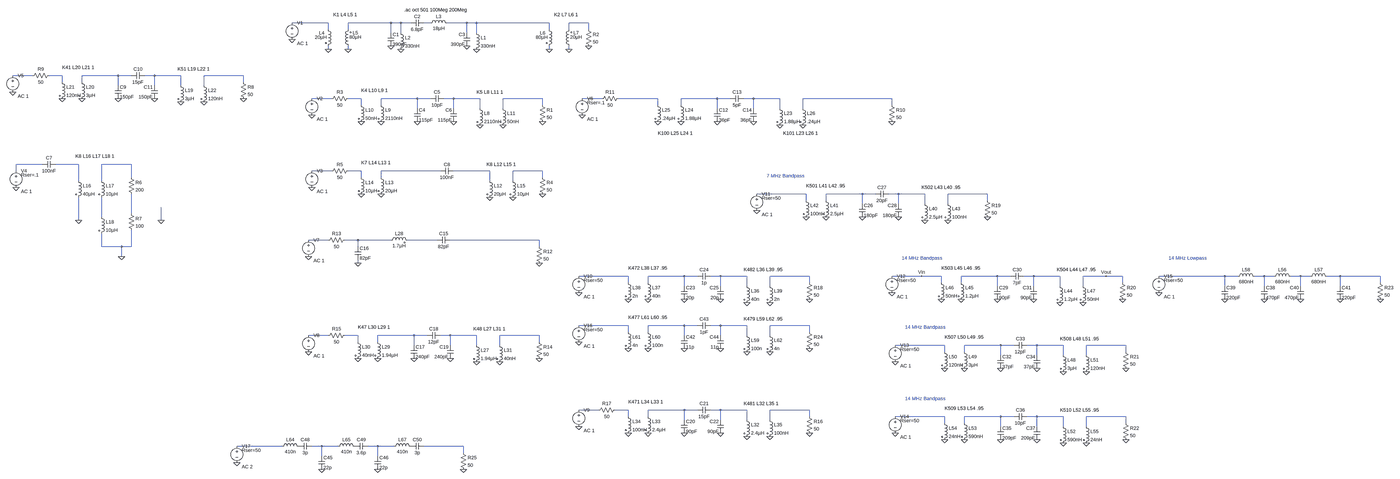
[diagram p0: schematic bandpass.asc, whole sheet]
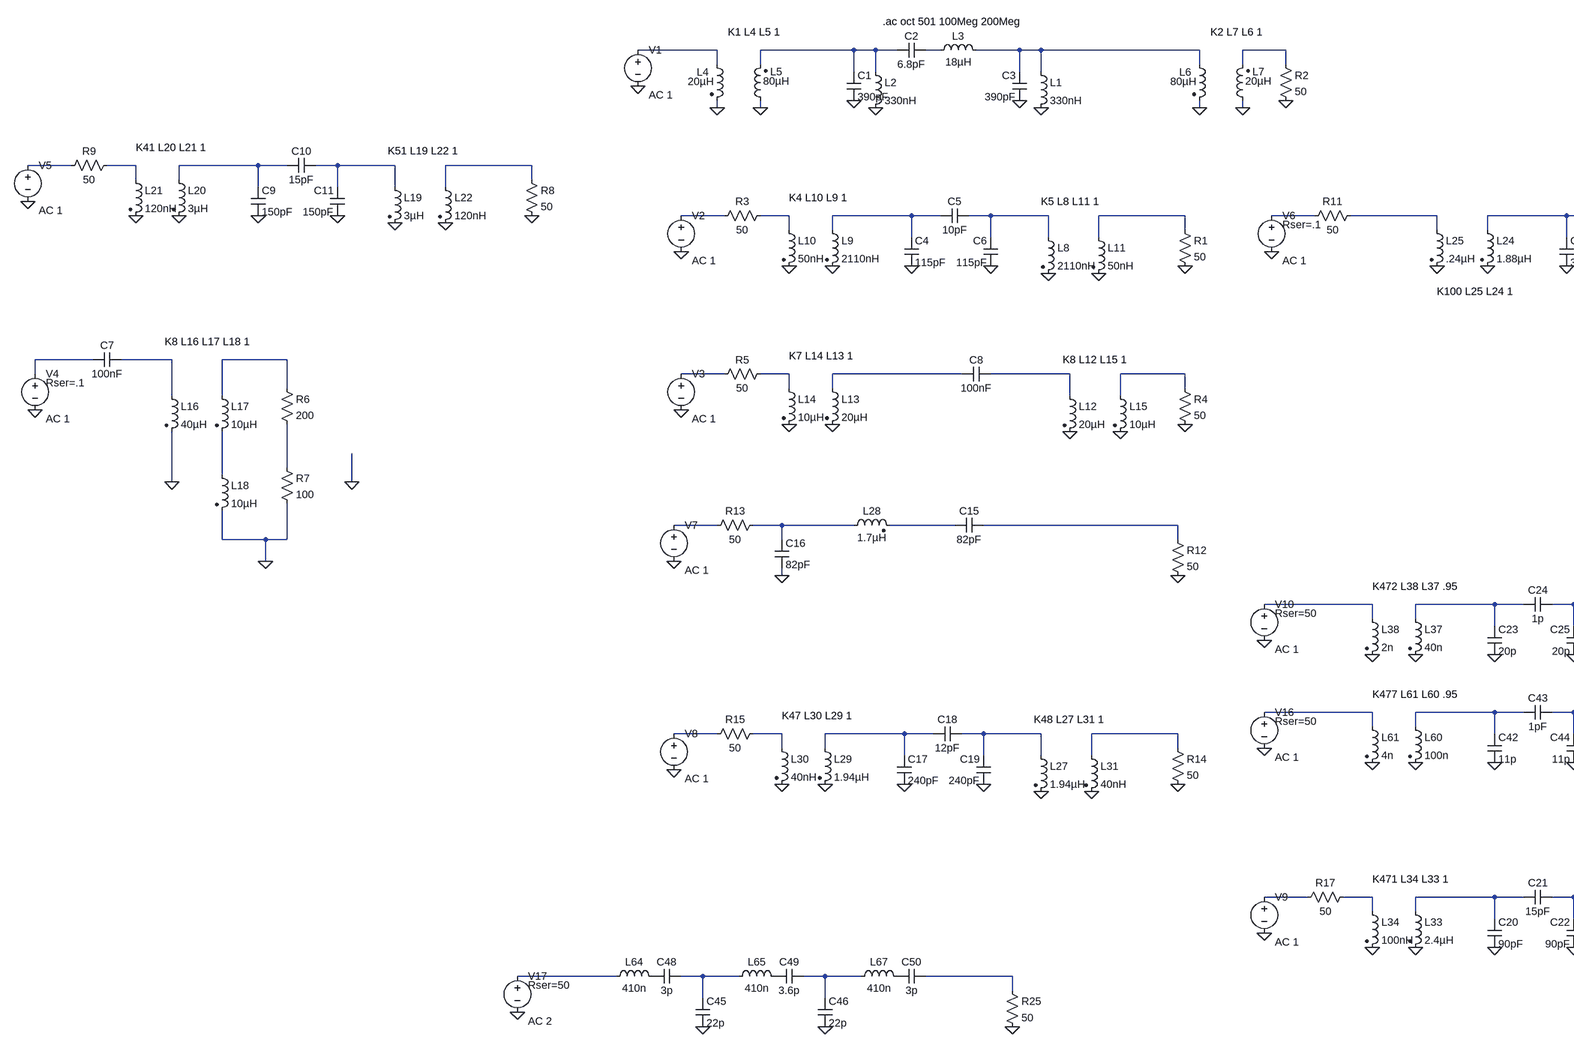
[diagram p1: schematic bandpass.asc, part, row 1 of 1, column 1 of 2]
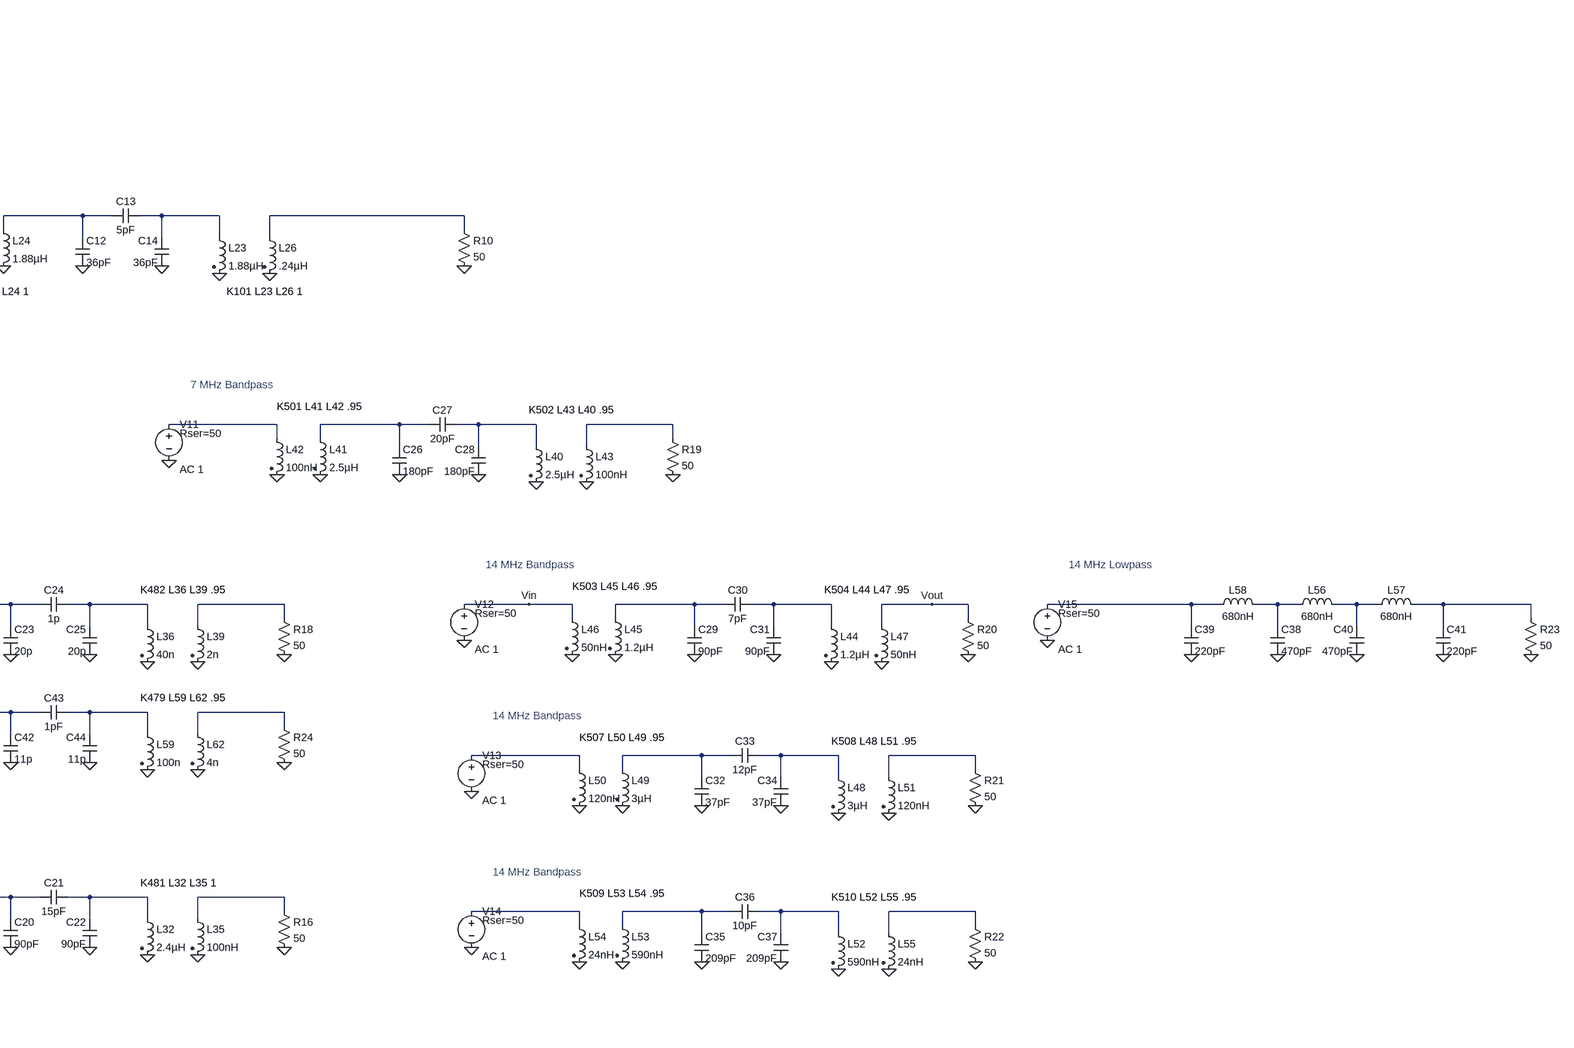
[diagram p2: schematic bandpass.asc, part, row 1 of 1, column 2 of 2]
bandpass.asc, the LTspice schematic file:
Version 4
SHEET 1 4948 2308
WIRE -272 96 -448 96
WIRE 32 96 -176 96
WIRE 80 96 32 96
WIRE 128 96 80 96
WIRE 224 96 192 96
WIRE 400 96 304 96
WIRE 448 96 400 96
WIRE 800 96 448 96
WIRE 992 96 896 96
WIRE -272 128 -272 96
WIRE -176 128 -176 96
WIRE 800 128 800 96
WIRE 896 128 896 96
WIRE 992 128 992 96
WIRE 32 144 32 96
WIRE 80 144 80 96
WIRE 400 144 400 96
WIRE 448 144 448 96
WIRE -272 224 -272 208
WIRE -176 224 -176 208
WIRE 800 224 800 208
WIRE 896 224 896 208
WIRE -1728 352 -1824 352
WIRE -1584 352 -1648 352
WIRE -1312 352 -1488 352
WIRE -1248 352 -1312 352
WIRE -1136 352 -1184 352
WIRE -1008 352 -1136 352
WIRE -704 352 -896 352
WIRE -1584 384 -1584 352
WIRE -1488 384 -1488 352
WIRE -704 384 -704 352
WIRE -1312 400 -1312 352
WIRE -1136 400 -1136 352
WIRE -1008 400 -1008 352
WIRE -896 400 -896 352
WIRE -256 464 -352 464
WIRE -112 464 -176 464
WIRE 160 464 -16 464
WIRE 224 464 160 464
WIRE 336 464 288 464
WIRE 464 464 336 464
WIRE 768 464 576 464
WIRE 1056 464 960 464
WIRE 1328 464 1136 464
WIRE 1616 464 1440 464
WIRE 1680 464 1616 464
WIRE 1792 464 1744 464
WIRE 1920 464 1792 464
WIRE 2464 464 2032 464
WIRE -112 496 -112 464
WIRE -16 496 -16 464
WIRE 768 496 768 464
WIRE 1328 496 1328 464
WIRE 1440 496 1440 464
WIRE 2464 496 2464 464
WIRE 160 512 160 464
WIRE 336 512 336 464
WIRE 464 512 464 464
WIRE 576 512 576 464
WIRE 1616 512 1616 464
WIRE 1792 512 1792 464
WIRE 1920 512 1920 464
WIRE 2032 512 2032 464
WIRE -1680 784 -1808 784
WIRE -1504 784 -1616 784
WIRE -1248 784 -1392 784
WIRE -1808 816 -1808 784
WIRE -256 816 -352 816
WIRE -112 816 -176 816
WIRE 272 816 -16 816
WIRE 512 816 336 816
WIRE 768 816 624 816
WIRE -1248 848 -1248 784
WIRE -112 848 -112 816
WIRE -16 848 -16 816
WIRE 768 848 768 816
WIRE -1504 864 -1504 784
WIRE -1392 864 -1392 784
WIRE 512 864 512 816
WIRE 624 864 624 816
WIRE 2048 928 1808 928
WIRE 2320 928 2144 928
WIRE 2384 928 2320 928
WIRE 2496 928 2448 928
WIRE 2624 928 2496 928
WIRE 2928 928 2736 928
WIRE 2048 960 2048 928
WIRE 2144 960 2144 928
WIRE 2928 960 2928 928
WIRE 2320 976 2320 928
WIRE 2496 976 2496 928
WIRE 2624 976 2624 928
WIRE 2736 976 2736 928
WIRE -1248 1024 -1248 928
WIRE -1392 1040 -1392 944
WIRE -1504 1056 -1504 944
WIRE -1104 1056 -1104 992
WIRE -272 1152 -368 1152
WIRE -128 1152 -192 1152
WIRE 32 1152 -128 1152
WIRE 256 1152 112 1152
WIRE 752 1152 320 1152
WIRE -1392 1184 -1392 1120
WIRE -1296 1184 -1392 1184
WIRE -1248 1184 -1248 1104
WIRE -1248 1184 -1296 1184
WIRE -128 1184 -128 1152
WIRE 752 1184 752 1152
WIRE -1296 1232 -1296 1184
WIRE -128 1264 -128 1248
WIRE 1184 1328 944 1328
WIRE 1456 1328 1280 1328
WIRE 1520 1328 1456 1328
WIRE 1632 1328 1584 1328
WIRE 1760 1328 1632 1328
WIRE 2064 1328 1872 1328
WIRE 2608 1328 2464 1328
WIRE 2704 1328 2608 1328
WIRE 2976 1328 2800 1328
WIRE 3040 1328 2976 1328
WIRE 3152 1328 3104 1328
WIRE 3280 1328 3152 1328
WIRE 3504 1328 3392 1328
WIRE 3584 1328 3504 1328
WIRE 4080 1328 3760 1328
WIRE 4144 1328 4080 1328
WIRE 4272 1328 4224 1328
WIRE 4320 1328 4272 1328
WIRE 4448 1328 4400 1328
WIRE 4496 1328 4448 1328
WIRE 4640 1328 4576 1328
WIRE 4880 1328 4640 1328
WIRE 1184 1360 1184 1328
WIRE 1280 1360 1280 1328
WIRE 2064 1360 2064 1328
WIRE 2704 1360 2704 1328
WIRE 2800 1360 2800 1328
WIRE 3584 1360 3584 1328
WIRE 4880 1360 4880 1328
WIRE 1456 1376 1456 1328
WIRE 1632 1376 1632 1328
WIRE 1760 1376 1760 1328
WIRE 1872 1376 1872 1328
WIRE 2976 1376 2976 1328
WIRE 3152 1376 3152 1328
WIRE 3280 1376 3280 1328
WIRE 3392 1376 3392 1328
WIRE 4080 1376 4080 1328
WIRE 4272 1376 4272 1328
WIRE 4448 1376 4448 1328
WIRE 4640 1376 4640 1328
WIRE 1184 1568 944 1568
WIRE 1456 1568 1280 1568
WIRE 1520 1568 1456 1568
WIRE 1632 1568 1584 1568
WIRE 1760 1568 1632 1568
WIRE 2064 1568 1872 1568
WIRE 1184 1600 1184 1568
WIRE 1280 1600 1280 1568
WIRE 2064 1600 2064 1568
WIRE -272 1616 -368 1616
WIRE -128 1616 -192 1616
WIRE 144 1616 -32 1616
WIRE 208 1616 144 1616
WIRE 320 1616 272 1616
WIRE 448 1616 320 1616
WIRE 752 1616 560 1616
WIRE 1456 1616 1456 1568
WIRE 1632 1616 1632 1568
WIRE 1760 1616 1760 1568
WIRE 1872 1616 1872 1568
WIRE -128 1648 -128 1616
WIRE -32 1648 -32 1616
WIRE 752 1648 752 1616
WIRE 144 1664 144 1616
WIRE 320 1664 320 1616
WIRE 448 1664 448 1616
WIRE 560 1664 560 1616
WIRE 2720 1664 2480 1664
WIRE 2992 1664 2816 1664
WIRE 3056 1664 2992 1664
WIRE 3168 1664 3120 1664
WIRE 3296 1664 3168 1664
WIRE 3600 1664 3408 1664
WIRE 2720 1696 2720 1664
WIRE 2816 1696 2816 1664
WIRE 3600 1696 3600 1664
WIRE 2992 1712 2992 1664
WIRE 3168 1712 3168 1664
WIRE 3296 1712 3296 1664
WIRE 3408 1712 3408 1664
WIRE 1040 1984 944 1984
WIRE 1184 1984 1120 1984
WIRE 1456 1984 1280 1984
WIRE 1520 1984 1456 1984
WIRE 1632 1984 1584 1984
WIRE 1760 1984 1632 1984
WIRE 2064 1984 1872 1984
WIRE 1184 2016 1184 1984
WIRE 1280 2016 1280 1984
WIRE 2064 2016 2064 1984
WIRE 2720 2016 2480 2016
WIRE 2992 2016 2816 2016
WIRE 3056 2016 2992 2016
WIRE 3168 2016 3120 2016
WIRE 3296 2016 3168 2016
WIRE 3600 2016 3408 2016
WIRE 1456 2032 1456 1984
WIRE 1632 2032 1632 1984
WIRE 1760 2032 1760 1984
WIRE 1872 2032 1872 1984
WIRE 2720 2048 2720 2016
WIRE 2816 2048 2816 2016
WIRE 3600 2048 3600 2016
WIRE 2992 2064 2992 2016
WIRE 3168 2064 3168 2016
WIRE 3296 2064 3296 2016
WIRE 3408 2064 3408 2016
WIRE -496 2160 -736 2160
WIRE -304 2160 -352 2160
WIRE -224 2160 -304 2160
WIRE -32 2160 -80 2160
WIRE 48 2160 -32 2160
WIRE 384 2160 192 2160
WIRE 384 2192 384 2160
WIRE -304 2208 -304 2160
WIRE -32 2208 -32 2160
FLAG 32 208 0
FLAG 80 224 0
FLAG 400 208 0
FLAG 448 224 0
FLAG -448 176 0
FLAG -272 224 0
FLAG -176 224 0
FLAG 800 224 0
FLAG 896 224 0
FLAG 992 208 0
FLAG 160 576 0
FLAG -16 576 0
FLAG 336 576 0
FLAG 464 592 0
FLAG -352 544 0
FLAG -112 576 0
FLAG 576 592 0
FLAG 768 576 0
FLAG -16 928 0
FLAG 512 944 0
FLAG -352 896 0
FLAG -112 928 0
FLAG 624 944 0
FLAG 768 928 0
FLAG -1808 896 0
FLAG -1504 1056 0
FLAG -1104 1056 0
FLAG -1296 1232 0
FLAG -1312 464 0
FLAG -1488 464 0
FLAG -1136 464 0
FLAG -1008 480 0
FLAG -1824 432 0
FLAG -1584 464 0
FLAG -896 480 0
FLAG -704 464 0
FLAG 1616 576 0
FLAG 1440 576 0
FLAG 1792 576 0
FLAG 1920 592 0
FLAG 960 544 0
FLAG 2464 576 0
FLAG 1328 576 0
FLAG 2032 592 0
FLAG -368 1232 0
FLAG -128 1264 0
FLAG 752 1264 0
FLAG 144 1728 0
FLAG -32 1728 0
FLAG 320 1728 0
FLAG 448 1744 0
FLAG -368 1696 0
FLAG -128 1728 0
FLAG 560 1744 0
FLAG 752 1728 0
FLAG 1456 2096 0
FLAG 1280 2096 0
FLAG 1632 2096 0
FLAG 1760 2112 0
FLAG 944 2064 0
FLAG 1184 2096 0
FLAG 1872 2112 0
FLAG 2064 2096 0
FLAG 1456 1440 0
FLAG 1280 1440 0
FLAG 1632 1440 0
FLAG 1760 1456 0
FLAG 944 1408 0
FLAG 1184 1440 0
FLAG 1872 1456 0
FLAG 2064 1440 0
FLAG 2320 1040 0
FLAG 2144 1040 0
FLAG 2496 1040 0
FLAG 2624 1056 0
FLAG 1808 1008 0
FLAG 2048 1040 0
FLAG 2736 1056 0
FLAG 2928 1040 0
FLAG 2976 1440 0
FLAG 2800 1440 0
FLAG 3152 1440 0
FLAG 3280 1456 0
FLAG 2464 1408 0
FLAG 2704 1440 0
FLAG 3392 1456 0
FLAG 3584 1440 0
FLAG 2608 1328 Vin
FLAG 3504 1328 Vout
FLAG 2992 1776 0
FLAG 2816 1776 0
FLAG 3168 1776 0
FLAG 3296 1792 0
FLAG 2480 1744 0
FLAG 2720 1776 0
FLAG 3408 1792 0
FLAG 3600 1776 0
FLAG 2992 2128 0
FLAG 2816 2128 0
FLAG 3168 2128 0
FLAG 3296 2144 0
FLAG 2480 2096 0
FLAG 2720 2128 0
FLAG 3408 2144 0
FLAG 3600 2128 0
FLAG 4272 1440 0
FLAG 4448 1440 0
FLAG 3760 1408 0
FLAG 4880 1440 0
FLAG 4080 1440 0
FLAG 4640 1440 0
FLAG 1456 1680 0
FLAG 1280 1680 0
FLAG 1632 1680 0
FLAG 1760 1696 0
FLAG 944 1648 0
FLAG 1184 1680 0
FLAG 1872 1696 0
FLAG 2064 1680 0
FLAG -736 2240 0
FLAG 384 2272 0
FLAG -304 2272 0
FLAG -32 2272 0
SYMBOL cap 16 144 R0
SYMATTR InstName C1
SYMATTR Value 390pF
SYMBOL cap 192 80 R90
WINDOW 0 0 32 VBottom 2
WINDOW 3 32 32 VTop 2
SYMATTR InstName C2
SYMATTR Value 6.8pF
SYMBOL cap 416 208 R180
WINDOW 0 24 56 Left 2
WINDOW 3 24 8 Left 2
SYMATTR InstName C3
SYMATTR Value 390pF
SYMBOL ind 432 128 R0
SYMATTR InstName L1
SYMATTR Value 330nH
SYMBOL ind 64 128 R0
SYMATTR InstName L2
SYMATTR Value 330nH
SYMBOL ind 208 112 R270
WINDOW 0 32 56 VTop 2
WINDOW 3 5 56 VBottom 2
SYMATTR InstName L3
SYMATTR Value 18µH
SYMBOL voltage -448 80 R0
WINDOW 123 24 116 Left 2
WINDOW 39 0 0 Left 0
SYMATTR Value2 AC 1
SYMATTR InstName V1
SYMATTR Value ""
SYMBOL ind2 -288 112 R0
WINDOW 0 -29 33 Left 2
WINDOW 3 -49 54 Left 2
SYMATTR InstName L4
SYMATTR Value 20µH
SYMATTR Type ind
SYMBOL ind2 -160 224 R180
WINDOW 0 -33 80 Left 2
WINDOW 3 -48 59 Left 2
SYMATTR InstName L5
SYMATTR Value 80µH
SYMATTR Type ind
SYMBOL ind2 784 112 R0
WINDOW 0 -29 33 Left 2
WINDOW 3 -49 54 Left 2
SYMATTR InstName L6
SYMATTR Value 80µH
SYMATTR Type ind
SYMBOL ind2 912 224 R180
WINDOW 0 -33 80 Left 2
WINDOW 3 -48 59 Left 2
SYMATTR InstName L7
SYMATTR Value 20µH
SYMATTR Type ind
SYMBOL res 976 112 R0
SYMATTR InstName R2
SYMATTR Value 50
SYMBOL cap 144 512 R0
SYMATTR InstName C4
SYMATTR Value 115pF
SYMBOL cap 288 448 R90
WINDOW 0 0 32 VBottom 2
WINDOW 3 32 32 VTop 2
SYMATTR InstName C5
SYMATTR Value 10pF
SYMBOL cap 352 576 R180
WINDOW 0 24 56 Left 2
WINDOW 3 24 8 Left 2
SYMATTR InstName C6
SYMATTR Value 115pF
SYMBOL ind2 448 496 R0
SYMATTR InstName L8
SYMATTR Value 2110nH
SYMATTR Type ind
SYMBOL ind2 -32 480 R0
SYMATTR InstName L9
SYMATTR Value 2110nH
SYMATTR Type ind
SYMBOL voltage -352 448 R0
WINDOW 123 24 116 Left 2
WINDOW 39 0 0 Left 0
SYMATTR Value2 AC 1
SYMATTR InstName V2
SYMATTR Value ""
SYMBOL ind2 -128 480 R0
SYMATTR InstName L10
SYMATTR Value 50nH
SYMATTR Type ind
SYMBOL ind2 560 496 R0
SYMATTR InstName L11
SYMATTR Value 50nH
SYMATTR Type ind
SYMBOL res 752 480 R0
SYMATTR InstName R1
SYMATTR Value 50
SYMBOL res -160 448 R90
WINDOW 0 0 56 VBottom 2
WINDOW 3 32 56 VTop 2
SYMATTR InstName R3
SYMATTR Value 50
SYMBOL cap 336 800 R90
WINDOW 0 0 32 VBottom 2
WINDOW 3 32 32 VTop 2
SYMATTR InstName C8
SYMATTR Value 100nF
SYMBOL ind2 496 848 R0
SYMATTR InstName L12
SYMATTR Value 20µH
SYMATTR Type ind
SYMBOL ind2 -32 832 R0
SYMATTR InstName L13
SYMATTR Value 20µH
SYMATTR Type ind
SYMBOL voltage -352 800 R0
WINDOW 123 24 116 Left 2
WINDOW 39 0 0 Left 0
SYMATTR Value2 AC 1
SYMATTR InstName V3
SYMATTR Value ""
SYMBOL ind2 -128 832 R0
SYMATTR InstName L14
SYMATTR Value 10µH
SYMATTR Type ind
SYMBOL ind2 608 848 R0
SYMATTR InstName L15
SYMATTR Value 10µH
SYMATTR Type ind
SYMBOL res 752 832 R0
SYMATTR InstName R4
SYMATTR Value 50
SYMBOL res -160 800 R90
WINDOW 0 0 56 VBottom 2
WINDOW 3 32 56 VTop 2
SYMATTR InstName R5
SYMATTR Value 50
SYMBOL ind2 -1520 848 R0
SYMATTR InstName L16
SYMATTR Value 40µH
SYMATTR Type ind
SYMBOL ind2 -1408 848 R0
SYMATTR InstName L17
SYMATTR Value 10µH
SYMATTR Type ind
SYMBOL voltage -1808 800 R0
WINDOW 123 24 116 Left 2
WINDOW 39 24 36 Left 2
SYMATTR Value2 AC 1
SYMATTR SpiceLine Rser=.1
SYMATTR InstName V4
SYMATTR Value ""
SYMBOL ind2 -1408 1024 R0
SYMATTR InstName L18
SYMATTR Value 10µH
SYMATTR Type ind
SYMBOL res -1264 832 R0
SYMATTR InstName R6
SYMATTR Value 200
SYMBOL res -1264 1008 R0
SYMATTR InstName R7
SYMATTR Value 100
SYMBOL cap -1616 768 R90
WINDOW 0 0 32 VBottom 2
WINDOW 3 32 32 VTop 2
SYMATTR InstName C7
SYMATTR Value 100nF
SYMBOL cap -1328 400 R0
SYMATTR InstName C9
SYMATTR Value 150pF
SYMBOL cap -1184 336 R90
WINDOW 0 0 32 VBottom 2
WINDOW 3 32 32 VTop 2
SYMATTR InstName C10
SYMATTR Value 15pF
SYMBOL cap -1120 464 R180
WINDOW 0 24 56 Left 2
WINDOW 3 24 8 Left 2
SYMATTR InstName C11
SYMATTR Value 150pF
SYMBOL ind2 -1024 384 R0
SYMATTR InstName L19
SYMATTR Value 3µH
SYMATTR Type ind
SYMBOL ind2 -1504 368 R0
SYMATTR InstName L20
SYMATTR Value 3µH
SYMATTR Type ind
SYMBOL voltage -1824 336 R0
WINDOW 123 24 116 Left 2
WINDOW 39 24 36 Left 2
SYMATTR Value2 AC 1
SYMATTR InstName V5
SYMATTR Value ""
SYMBOL ind2 -1600 368 R0
SYMATTR InstName L21
SYMATTR Value 120nH
SYMATTR Type ind
SYMBOL ind2 -912 384 R0
SYMATTR InstName L22
SYMATTR Value 120nH
SYMATTR Type ind
SYMBOL res -720 368 R0
SYMATTR InstName R8
SYMATTR Value 50
SYMBOL res -1632 336 R90
WINDOW 0 0 56 VBottom 2
WINDOW 3 32 56 VTop 2
SYMATTR InstName R9
SYMATTR Value 50
SYMBOL cap 1600 512 R0
SYMATTR InstName C12
SYMATTR Value 36pF
SYMBOL cap 1744 448 R90
WINDOW 0 0 32 VBottom 2
WINDOW 3 32 32 VTop 2
SYMATTR InstName C13
SYMATTR Value 5pF
SYMBOL cap 1808 576 R180
WINDOW 0 24 56 Left 2
WINDOW 3 24 8 Left 2
SYMATTR InstName C14
SYMATTR Value 36pF
SYMBOL ind2 1904 496 R0
SYMATTR InstName L23
SYMATTR Value 1.88µH
SYMATTR Type ind
SYMBOL ind2 1424 480 R0
SYMATTR InstName L24
SYMATTR Value 1.88µH
SYMATTR Type ind
SYMBOL voltage 960 448 R0
WINDOW 123 24 116 Left 2
WINDOW 39 24 36 Left 2
SYMATTR Value2 AC 1
SYMATTR SpiceLine Rser=.1
SYMATTR InstName V6
SYMATTR Value ""
SYMBOL res 2448 480 R0
SYMATTR InstName R10
SYMATTR Value 50
SYMBOL res 1152 448 R90
WINDOW 0 0 56 VBottom 2
WINDOW 3 32 56 VTop 2
SYMATTR InstName R11
SYMATTR Value 50
SYMBOL ind2 1312 480 R0
SYMATTR InstName L25
SYMATTR Value .24µH
SYMATTR Type ind
SYMBOL ind2 2016 496 R0
SYMATTR InstName L26
SYMATTR Value .24µH
SYMATTR Type ind
SYMBOL cap 320 1136 R90
WINDOW 0 0 32 VBottom 2
WINDOW 3 32 32 VTop 2
SYMATTR InstName C15
SYMATTR Value 82pF
SYMBOL ind2 16 1168 R270
WINDOW 0 32 56 VTop 2
WINDOW 3 4 56 VBottom 2
SYMATTR InstName L28
SYMATTR Value 1.7µH
SYMATTR Type ind
SYMBOL voltage -368 1136 R0
WINDOW 123 24 116 Left 2
WINDOW 39 0 0 Left 0
SYMATTR Value2 AC 1
SYMATTR InstName V7
SYMATTR Value ""
SYMBOL res 736 1168 R0
SYMATTR InstName R12
SYMATTR Value 50
SYMBOL res -176 1136 R90
WINDOW 0 0 56 VBottom 2
WINDOW 3 32 56 VTop 2
SYMATTR InstName R13
SYMATTR Value 50
SYMBOL cap -144 1184 R0
SYMATTR InstName C16
SYMATTR Value 82pF
SYMBOL cap 128 1664 R0
SYMATTR InstName C17
SYMATTR Value 240pF
SYMBOL cap 272 1600 R90
WINDOW 0 0 32 VBottom 2
WINDOW 3 32 32 VTop 2
SYMATTR InstName C18
SYMATTR Value 12pF
SYMBOL cap 336 1728 R180
WINDOW 0 24 56 Left 2
WINDOW 3 24 8 Left 2
SYMATTR InstName C19
SYMATTR Value 240pF
SYMBOL ind2 432 1648 R0
SYMATTR InstName L27
SYMATTR Value 1.94µH
SYMATTR Type ind
SYMBOL ind2 -48 1632 R0
SYMATTR InstName L29
SYMATTR Value 1.94µH
SYMATTR Type ind
SYMBOL voltage -368 1600 R0
WINDOW 123 24 116 Left 2
WINDOW 39 0 0 Left 0
SYMATTR Value2 AC 1
SYMATTR InstName V8
SYMATTR Value ""
SYMBOL ind2 -144 1632 R0
SYMATTR InstName L30
SYMATTR Value 40nH
SYMATTR Type ind
SYMBOL ind2 544 1648 R0
SYMATTR InstName L31
SYMATTR Value 40nH
SYMATTR Type ind
SYMBOL res 736 1632 R0
SYMATTR InstName R14
SYMATTR Value 50
SYMBOL res -176 1600 R90
WINDOW 0 0 56 VBottom 2
WINDOW 3 32 56 VTop 2
SYMATTR InstName R15
SYMATTR Value 50
SYMBOL cap 1440 2032 R0
SYMATTR InstName C20
SYMATTR Value 90pF
SYMBOL cap 1584 1968 R90
WINDOW 0 0 32 VBottom 2
WINDOW 3 32 32 VTop 2
SYMATTR InstName C21
SYMATTR Value 15pF
SYMBOL cap 1648 2096 R180
WINDOW 0 24 56 Left 2
WINDOW 3 24 8 Left 2
SYMATTR InstName C22
SYMATTR Value 90pF
SYMBOL ind2 1744 2016 R0
SYMATTR InstName L32
SYMATTR Value 2.4µH
SYMATTR Type ind
SYMBOL ind2 1264 2000 R0
SYMATTR InstName L33
SYMATTR Value 2.4µH
SYMATTR Type ind
SYMBOL voltage 944 1968 R0
WINDOW 123 24 116 Left 2
WINDOW 39 0 0 Left 0
SYMATTR Value2 AC 1
SYMATTR InstName V9
SYMATTR Value ""
SYMBOL ind2 1168 2000 R0
SYMATTR InstName L34
SYMATTR Value 100nH
SYMATTR Type ind
SYMBOL ind2 1856 2016 R0
SYMATTR InstName L35
SYMATTR Value 100nH
SYMATTR Type ind
SYMBOL res 2048 2000 R0
SYMATTR InstName R16
SYMATTR Value 50
SYMBOL res 1136 1968 R90
WINDOW 0 0 56 VBottom 2
WINDOW 3 32 56 VTop 2
SYMATTR InstName R17
SYMATTR Value 50
SYMBOL cap 1440 1376 R0
SYMATTR InstName C23
SYMATTR Value 20p
SYMBOL cap 1584 1312 R90
WINDOW 0 0 32 VBottom 2
WINDOW 3 32 32 VTop 2
SYMATTR InstName C24
SYMATTR Value 1p
SYMBOL cap 1648 1440 R180
WINDOW 0 24 56 Left 2
WINDOW 3 24 8 Left 2
SYMATTR InstName C25
SYMATTR Value 20p
SYMBOL ind2 1744 1360 R0
SYMATTR InstName L36
SYMATTR Value 40n
SYMATTR Type ind
SYMBOL ind2 1264 1344 R0
SYMATTR InstName L37
SYMATTR Value 40n
SYMATTR Type ind
SYMBOL voltage 944 1312 R0
WINDOW 123 24 116 Left 2
WINDOW 39 24 36 Left 2
SYMATTR Value2 AC 1
SYMATTR SpiceLine Rser=50
SYMATTR InstName V10
SYMATTR Value ""
SYMBOL ind2 1168 1344 R0
SYMATTR InstName L38
SYMATTR Value 2n
SYMATTR Type ind
SYMBOL ind2 1856 1360 R0
SYMATTR InstName L39
SYMATTR Value 2n
SYMATTR Type ind
SYMBOL res 2048 1344 R0
SYMATTR InstName R18
SYMATTR Value 50
SYMBOL cap 2304 976 R0
SYMATTR InstName C26
SYMATTR Value 180pF
SYMBOL cap 2448 912 R90
WINDOW 0 0 32 VBottom 2
WINDOW 3 32 32 VTop 2
SYMATTR InstName C27
SYMATTR Value 20pF
SYMBOL cap 2512 1040 R180
WINDOW 0 24 56 Left 2
WINDOW 3 24 8 Left 2
SYMATTR InstName C28
SYMATTR Value 180pF
SYMBOL ind2 2608 960 R0
SYMATTR InstName L40
SYMATTR Value 2.5µH
SYMATTR Type ind
SYMBOL ind2 2128 944 R0
SYMATTR InstName L41
SYMATTR Value 2.5µH
SYMATTR Type ind
SYMBOL voltage 1808 912 R0
WINDOW 123 24 116 Left 2
WINDOW 39 24 36 Left 2
SYMATTR Value2 AC 1
SYMATTR SpiceLine Rser=50
SYMATTR InstName V11
SYMATTR Value ""
SYMBOL ind2 2032 944 R0
SYMATTR InstName L42
SYMATTR Value 100nH
SYMATTR Type ind
SYMBOL ind2 2720 960 R0
SYMATTR InstName L43
SYMATTR Value 100nH
SYMATTR Type ind
SYMBOL res 2912 944 R0
SYMATTR InstName R19
SYMATTR Value 50
SYMBOL cap 2960 1376 R0
SYMATTR InstName C29
SYMATTR Value 90pF
SYMBOL cap 3104 1312 R90
WINDOW 0 0 32 VBottom 2
WINDOW 3 32 32 VTop 2
SYMATTR InstName C30
SYMATTR Value 7pF
SYMBOL cap 3168 1440 R180
WINDOW 0 24 56 Left 2
WINDOW 3 24 8 Left 2
SYMATTR InstName C31
SYMATTR Value 90pF
SYMBOL ind2 3264 1360 R0
SYMATTR InstName L44
SYMATTR Value 1.2µH
SYMATTR Type ind
SYMBOL ind2 2784 1344 R0
SYMATTR InstName L45
SYMATTR Value 1.2µH
SYMATTR Type ind
SYMBOL voltage 2464 1312 R0
WINDOW 123 24 116 Left 2
WINDOW 39 24 36 Left 2
SYMATTR Value2 AC 1
SYMATTR SpiceLine Rser=50
SYMATTR InstName V12
SYMATTR Value ""
SYMBOL ind2 2688 1344 R0
SYMATTR InstName L46
SYMATTR Value 50nH
SYMATTR Type ind
SYMBOL ind2 3376 1360 R0
SYMATTR InstName L47
SYMATTR Value 50nH
SYMATTR Type ind
SYMBOL res 3568 1344 R0
SYMATTR InstName R20
SYMATTR Value 50
SYMBOL cap 2976 1712 R0
SYMATTR InstName C32
SYMATTR Value 37pF
SYMBOL cap 3120 1648 R90
WINDOW 0 0 32 VBottom 2
WINDOW 3 32 32 VTop 2
SYMATTR InstName C33
SYMATTR Value 12pF
SYMBOL cap 3184 1776 R180
WINDOW 0 24 56 Left 2
WINDOW 3 24 8 Left 2
SYMATTR InstName C34
SYMATTR Value 37pF
SYMBOL ind2 3280 1696 R0
SYMATTR InstName L48
SYMATTR Value 3µH
SYMATTR Type ind
SYMBOL ind2 2800 1680 R0
SYMATTR InstName L49
SYMATTR Value 3µH
SYMATTR Type ind
SYMBOL voltage 2480 1648 R0
WINDOW 123 24 116 Left 2
WINDOW 39 24 36 Left 2
SYMATTR Value2 AC 1
SYMATTR SpiceLine Rser=50
SYMATTR InstName V13
SYMATTR Value ""
SYMBOL ind2 2704 1680 R0
SYMATTR InstName L50
SYMATTR Value 120nH
SYMATTR Type ind
SYMBOL ind2 3392 1696 R0
SYMATTR InstName L51
SYMATTR Value 120nH
SYMATTR Type ind
SYMBOL res 3584 1680 R0
SYMATTR InstName R21
SYMATTR Value 50
SYMBOL cap 2976 2064 R0
SYMATTR InstName C35
SYMATTR Value 209pF
SYMBOL cap 3120 2000 R90
WINDOW 0 0 32 VBottom 2
WINDOW 3 32 32 VTop 2
SYMATTR InstName C36
SYMATTR Value 10pF
SYMBOL cap 3184 2128 R180
WINDOW 0 24 56 Left 2
WINDOW 3 24 8 Left 2
SYMATTR InstName C37
SYMATTR Value 209pF
SYMBOL ind2 3280 2048 R0
SYMATTR InstName L52
SYMATTR Value 590nH
SYMATTR Type ind
SYMBOL ind2 2800 2032 R0
SYMATTR InstName L53
SYMATTR Value 590nH
SYMATTR Type ind
SYMBOL voltage 2480 2000 R0
WINDOW 123 24 116 Left 2
WINDOW 39 24 36 Left 2
SYMATTR Value2 AC 1
SYMATTR SpiceLine Rser=50
SYMATTR InstName V14
SYMATTR Value ""
SYMBOL ind2 2704 2032 R0
SYMATTR InstName L54
SYMATTR Value 24nH
SYMATTR Type ind
SYMBOL ind2 3392 2048 R0
SYMATTR InstName L55
SYMATTR Value 24nH
SYMATTR Type ind
SYMBOL res 3584 2032 R0
SYMATTR InstName R22
SYMATTR Value 50
SYMBOL cap 4256 1376 R0
SYMATTR InstName C38
SYMATTR Value 470pF
SYMBOL cap 4464 1440 R180
WINDOW 0 24 56 Left 2
WINDOW 3 24 8 Left 2
SYMATTR InstName C40
SYMATTR Value 470pF
SYMBOL voltage 3760 1312 R0
WINDOW 123 24 116 Left 2
WINDOW 39 24 36 Left 2
SYMATTR Value2 AC 1
SYMATTR SpiceLine Rser=50
SYMATTR InstName V15
SYMATTR Value ""
SYMBOL res 4864 1344 R0
SYMATTR InstName R23
SYMATTR Value 50
SYMBOL ind 4304 1344 R270
WINDOW 0 32 56 VTop 2
WINDOW 3 5 56 VBottom 2
SYMATTR InstName L56
SYMATTR Value 680nH
SYMBOL ind 4480 1344 R270
WINDOW 0 32 56 VTop 2
WINDOW 3 5 56 VBottom 2
SYMATTR InstName L57
SYMATTR Value 680nH
SYMBOL ind 4128 1344 R270
WINDOW 0 32 56 VTop 2
WINDOW 3 5 56 VBottom 2
SYMATTR InstName L58
SYMATTR Value 680nH
SYMBOL cap 4064 1376 R0
SYMATTR InstName C39
SYMATTR Value 220pF
SYMBOL cap 4624 1376 R0
SYMATTR InstName C41
SYMATTR Value 220pF
SYMBOL cap 1440 1616 R0
SYMATTR InstName C42
SYMATTR Value 11p
SYMBOL cap 1584 1552 R90
WINDOW 0 0 32 VBottom 2
WINDOW 3 32 32 VTop 2
SYMATTR InstName C43
SYMATTR Value 1pF
SYMBOL cap 1648 1680 R180
WINDOW 0 24 56 Left 2
WINDOW 3 24 8 Left 2
SYMATTR InstName C44
SYMATTR Value 11p
SYMBOL ind2 1744 1600 R0
SYMATTR InstName L59
SYMATTR Value 100n
SYMATTR Type ind
SYMBOL ind2 1264 1584 R0
SYMATTR InstName L60
SYMATTR Value 100n
SYMATTR Type ind
SYMBOL voltage 944 1552 R0
WINDOW 123 24 116 Left 2
WINDOW 39 24 36 Left 2
SYMATTR Value2 AC 1
SYMATTR SpiceLine Rser=50
SYMATTR InstName V16
SYMATTR Value ""
SYMBOL ind2 1168 1584 R0
SYMATTR InstName L61
SYMATTR Value 4n
SYMATTR Type ind
SYMBOL ind2 1856 1600 R0
SYMATTR InstName L62
SYMATTR Value 4n
SYMATTR Type ind
SYMBOL res 2048 1584 R0
SYMATTR InstName R24
SYMATTR Value 50
SYMBOL voltage -736 2144 R0
WINDOW 123 24 116 Left 2
WINDOW 39 24 36 Left 2
SYMATTR Value2 AC 2
SYMATTR SpiceLine Rser=50
SYMATTR InstName V17
SYMATTR Value ""
SYMBOL res 368 2176 R0
SYMATTR InstName R25
SYMATTR Value 50
SYMBOL ind -512 2176 R270
WINDOW 0 32 56 VTop 2
WINDOW 3 5 56 VBottom 2
SYMATTR InstName L64
SYMATTR Value 410n
SYMBOL cap -352 2144 R90
WINDOW 0 0 32 VBottom 2
WINDOW 3 32 32 VTop 2
SYMATTR InstName C48
SYMATTR Value 3p
SYMBOL ind -240 2176 R270
WINDOW 0 32 56 VTop 2
WINDOW 3 5 56 VBottom 2
SYMATTR InstName L65
SYMATTR Value 410n
SYMBOL cap -80 2144 R90
WINDOW 0 0 32 VBottom 2
WINDOW 3 32 32 VTop 2
SYMATTR InstName C49
SYMATTR Value 3.6p
SYMBOL ind 32 2176 R270
WINDOW 0 32 56 VTop 2
WINDOW 3 5 56 VBottom 2
SYMATTR InstName L67
SYMATTR Value 410n
SYMBOL cap 192 2144 R90
WINDOW 0 0 32 VBottom 2
WINDOW 3 32 32 VTop 2
SYMATTR InstName C50
SYMATTR Value 3p
SYMBOL cap -320 2208 R0
SYMATTR InstName C45
SYMATTR Value 22p
SYMBOL cap -48 2208 R0
SYMATTR InstName C46
SYMATTR Value 22p
TEXT 96 32 Left 2 !.ac oct 501 100Meg 200Meg
TEXT -248 56 Left 2 !K1 L4 L5 1
TEXT 824 56 Left 2 !K2 L7 L6 1
TEXT -112 424 Left 2 !K4 L10 L9 1
TEXT 448 432 Left 2 !K5 L8 L11 1
TEXT -112 776 Left 2 !K7 L14 L13 1
TEXT 496 784 Left 2 !K8 L12 L15 1
TEXT -1520 744 Left 2 !K8 L16 L17 L18 1
TEXT -1584 312 Left 2 !K41 L20 L21 1
TEXT -1024 320 Left 2 !K51 L19 L22 1
TEXT 1328 632 Left 2 !K100 L25 L24 1
TEXT 1936 632 Left 2 !K101 L23 L26 1
TEXT -128 1576 Left 2 !K47 L30 L29 1
TEXT 432 1584 Left 2 !K48 L27 L31 1
TEXT 1184 1944 Left 2 !K471 L34 L33 1
TEXT 1744 1952 Left 2 !K481 L32 L35 1
TEXT 1184 1288 Left 2 !K472 L38 L37 .95
TEXT 1744 1296 Left 2 !K482 L36 L39 .95
TEXT 2048 888 Left 2 !K501 L41 L42 .95
TEXT 2608 896 Left 2 !K502 L43 L40 .95
TEXT 1856 840 Left 2 ;7 MHz Bandpass
TEXT 2704 1288 Left 2 !K503 L45 L46 .95
TEXT 3264 1296 Left 2 !K504 L44 L47 .95
TEXT 2512 1240 Left 2 ;14 MHz Bandpass
TEXT 2720 1624 Left 2 !K507 L50 L49 .95
TEXT 3280 1632 Left 2 !K508 L48 L51 .95
TEXT 2528 1576 Left 2 ;14 MHz Bandpass
TEXT 2720 1976 Left 2 !K509 L53 L54 .95
TEXT 3280 1984 Left 2 !K510 L52 L55 .95
TEXT 2528 1928 Left 2 ;14 MHz Bandpass
TEXT 3808 1240 Left 2 ;14 MHz Lowpass
TEXT 1184 1528 Left 2 !K477 L61 L60 .95
TEXT 1744 1536 Left 2 !K479 L59 L62 .95

The netlist it stands for:
* bandpass.asc
C1 N002 0 390pF
C2 N003 N002 6.8pF
C3 0 N004 390pF
L1 N004 0 330nH
L2 N002 0 330nH
L3 N003 N004 18µH
V1 N001 0 AC 1
L4 N001 0 20µH
L5 0 N002 80µH
L6 N004 0 80µH
L7 0 N005 20µH
R2 N005 0 50
C4 N013 0 115pF
C5 N014 N013 10pF
C6 0 N014 115pF
L8 N014 0 2110nH
L9 N013 0 2110nH
V2 N011 0 AC 1
L10 N012 0 50nH
L11 N015 0 50nH
R1 N015 0 50
R3 N012 N011 50
C8 N027 N026 100nF
L12 N027 0 20µH
L13 N026 0 20µH
V3 N024 0 AC 1
L14 N025 0 10µH
L15 N028 0 10µH
R4 N028 0 50
R5 N025 N024 50
L16 N022 0 40µH
L17 N023 N034 10µH
V4 N021 0 AC 1 Rser=.1
L18 N034 0 10µH
R6 N023 N033 200
R7 N033 0 100
C7 N022 N021 100nF
C9 N008 0 150pF
C10 N009 N008 15pF
C11 0 N009 150pF
L19 N009 0 3µH
L20 N008 0 3µH
V5 N006 0 AC 1
L21 N007 0 120nH
L22 N010 0 120nH
R8 N010 0 50
R9 N007 N006 50
C12 N018 0 36pF
C13 N019 N018 5pF
C14 0 N019 36pF
L23 N019 0 1.88µH
L24 N018 0 1.88µH
V6 N016 0 AC 1 Rser=.1
R10 N020 0 50
R11 N017 N016 50
L25 N017 0 .24µH
L26 N020 0 .24µH
C15 N038 N037 82pF
L28 N036 N037 1.7µH
V7 N035 0 AC 1
R12 N038 0 50
R13 N036 N035 50
C16 N036 0 82pF
C17 N055 0 240pF
C18 N056 N055 12pF
C19 0 N056 240pF
L27 N056 0 1.94µH
L29 N055 0 1.94µH
V8 N053 0 AC 1
L30 N054 0 40nH
L31 N057 0 40nH
R14 N057 0 50
R15 N054 N053 50
C20 N064 0 90pF
C21 N065 N064 15pF
C22 0 N065 90pF
L32 N065 0 2.4µH
L33 N064 0 2.4µH
V9 N062 0 AC 1
L34 N063 0 100nH
L35 N066 0 100nH
R16 N066 0 50
R17 N063 N062 50
C23 N040 0 20p
C24 N041 N040 1p
C25 0 N041 20p
L36 N041 0 40n
L37 N040 0 40n
V10 N039 0 AC 1 Rser=50
L38 N039 0 2n
L39 N042 0 2n
R18 N042 0 50
C26 N030 0 180pF
C27 N031 N030 20pF
C28 0 N031 180pF
L40 N031 0 2.5µH
L41 N030 0 2.5µH
V11 N029 0 AC 1 Rser=50
L42 N029 0 100nH
L43 N032 0 100nH
R19 N032 0 50
C29 N043 0 90pF
C30 N044 N043 7pF
C31 0 N044 90pF
L44 N044 0 1.2µH
L45 N043 0 1.2µH
V12 Vin 0 AC 1 Rser=50
L46 Vin 0 50nH
L47 Vout 0 50nH
R20 Vout 0 50
C32 N059 0 37pF
C33 N060 N059 12pF
C34 0 N060 37pF
L48 N060 0 3µH
L49 N059 0 3µH
V13 N058 0 AC 1 Rser=50
L50 N058 0 120nH
L51 N061 0 120nH
R21 N061 0 50
C35 N068 0 209pF
C36 N069 N068 10pF
C37 0 N069 209pF
L52 N069 0 590nH
L53 N068 0 590nH
V14 N067 0 AC 1 Rser=50
L54 N067 0 24nH
L55 N070 0 24nH
R22 N070 0 50
C38 N046 0 470pF
C40 0 N047 470pF
V15 N045 0 AC 1 Rser=50
R23 N048 0 50
L56 N046 N047 680nH
L57 N047 N048 680nH
L58 N045 N046 680nH
C39 N045 0 220pF
C41 N048 0 220pF
C42 N050 0 11p
C43 N051 N050 1pF
C44 0 N051 11p
L59 N051 0 100n
L60 N050 0 100n
V16 N049 0 AC 1 Rser=50
L61 N049 0 4n
L62 N052 0 4n
R24 N052 0 50
V17 N071 0 AC 2 Rser=50
R25 N074 0 50
L64 N071 P001 410n
C48 N072 P001 3p
L65 N072 P002 410n
C49 N073 P002 3.6p
L67 N073 P003 410n
C50 N074 P003 3p
C45 N072 0 22p
C46 N073 0 22p
.ac oct 501 100Meg 200Meg
K1 L4 L5 1
K2 L7 L6 1
K4 L10 L9 1
K5 L8 L11 1
K7 L14 L13 1
K8 L12 L15 1
K8 L16 L17 L18 1
K41 L20 L21 1
K51 L19 L22 1
K100 L25 L24 1
K101 L23 L26 1
K47 L30 L29 1
K48 L27 L31 1
K471 L34 L33 1
K481 L32 L35 1
K472 L38 L37 .95
K482 L36 L39 .95
K501 L41 L42 .95
K502 L43 L40 .95
* 7 MHz Bandpass
K503 L45 L46 .95
K504 L44 L47 .95
* 14 MHz Bandpass
K507 L50 L49 .95
K508 L48 L51 .95
* 14 MHz Bandpass
K509 L53 L54 .95
K510 L52 L55 .95
* 14 MHz Bandpass
* 14 MHz Lowpass
K477 L61 L60 .95
K479 L59 L62 .95
.backanno
.end

* Results of the author's LTspice run, read from the files saved beside the schematic
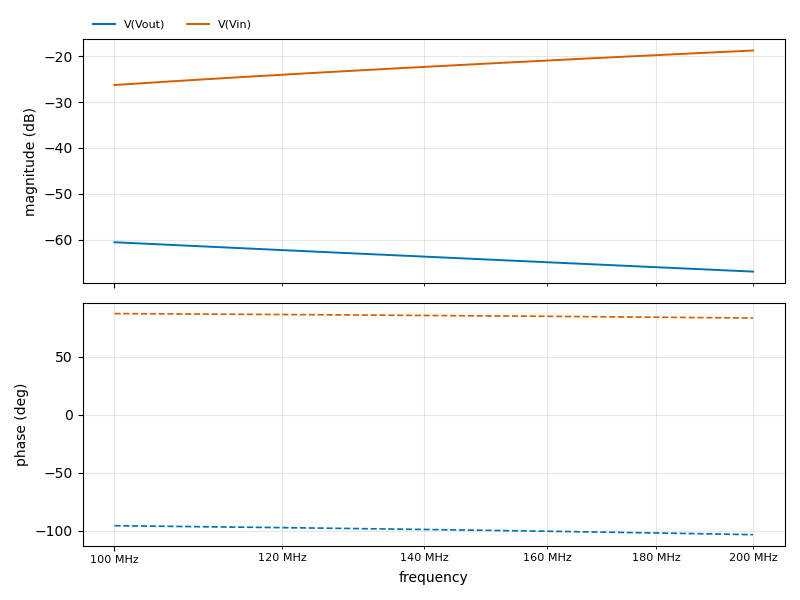
[diagram p3: AC Analysis of bandpass.asc, plotted from the saved traces]
* AC Analysis, 1 run:
*   V(Vout): -60.60 dB at 100 MHz, -67.00 dB at 200 MHz, peak -60.60 dB at 100 MHz, 3 dB below the peak at 138 MHz
*   V(Vin): -26.28 dB at 100 MHz, -18.75 dB at 200 MHz, peak -18.75 dB at 200 MHz, 3 dB below the peak at 147.6 MHz